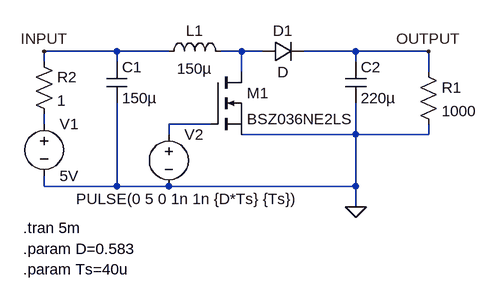
[diagram p0: schematic Boost converter_LT.asc]
Boost converter_LT.asc, the LTspice schematic file:
Version 4
SHEET 1 880 680
WIRE -48 -352 -160 -352
WIRE 32 -352 -48 -352
WIRE 144 -352 112 -352
WIRE 176 -352 144 -352
WIRE 320 -352 240 -352
WIRE 432 -352 320 -352
WIRE -160 -336 -160 -352
WIRE -48 -336 -48 -352
WIRE 320 -336 320 -352
WIRE 144 -320 144 -352
WIRE 432 -320 432 -352
WIRE -160 -240 -160 -256
WIRE 96 -240 32 -240
WIRE 32 -224 32 -240
WIRE 320 -224 320 -272
WIRE 320 -224 144 -224
WIRE 432 -224 432 -240
WIRE 432 -224 320 -224
WIRE -160 -144 -160 -160
WIRE -48 -144 -48 -272
WIRE -48 -144 -160 -144
WIRE 32 -144 -48 -144
WIRE 320 -144 320 -224
WIRE 320 -144 32 -144
WIRE 320 -112 320 -144
FLAG 320 -112 0
FLAG 432 -352 OUTPUT
FLAG -160 -352 INPUT
SYMBOL ind 16 -336 R270
WINDOW 0 32 56 VTop 2
WINDOW 3 5 56 VBottom 2
SYMATTR InstName L1
SYMATTR Value 150µ
SYMBOL cap -64 -336 R0
SYMATTR InstName C1
SYMATTR Value 150µ
SYMBOL cap 304 -336 R0
SYMATTR InstName C2
SYMATTR Value 220µ
SYMBOL diode 176 -336 R270
WINDOW 0 32 32 VTop 2
WINDOW 3 0 32 VBottom 2
SYMATTR InstName D1
SYMBOL res 416 -336 R0
SYMATTR InstName R1
SYMATTR Value 1000
SYMBOL nmos 96 -320 R0
SYMATTR InstName M1
SYMATTR Value BSZ036NE2LS
SYMBOL voltage -160 -256 R0
WINDOW 123 0 0 Left 0
WINDOW 39 0 0 Left 0
SYMATTR InstName V1
SYMATTR Value 5V
SYMBOL voltage 32 -240 R0
WINDOW 3 -143 115 Left 2
WINDOW 123 0 0 Left 0
WINDOW 39 0 0 Left 0
SYMATTR InstName V2
SYMATTR Value PULSE(0 5 0 1n 1n {D*Ts} {Ts})
SYMBOL res -176 -352 R0
SYMATTR InstName R2
SYMATTR Value 1
TEXT -192 -80 Left 2 !.tran 5m
TEXT -192 -48 Left 2 !.param D=0.583
TEXT -192 -16 Left 2 !.param Ts=40u

The netlist it stands for:
* Boost converter_LT.asc
L1 INPUT N001 150µ
C1 INPUT 0 150µ
C2 OUTPUT 0 220µ
D1 N001 OUTPUT D
R1 OUTPUT 0 1000
M1 N001 N003 0 0 BSZ036NE2LS
V1 N002 0 5V
V2 N003 0 PULSE(0 5 0 1n 1n {D*Ts} {Ts})
R2 INPUT N002 1
.model D D
.lib standard.dio
.model NMOS NMOS
.model PMOS PMOS
.lib standard.mos
.tran 5m
.param D=0.583
.param Ts=40u
.backanno
.end